# EAGLE design soth-core (EAGLE 7.2.0)
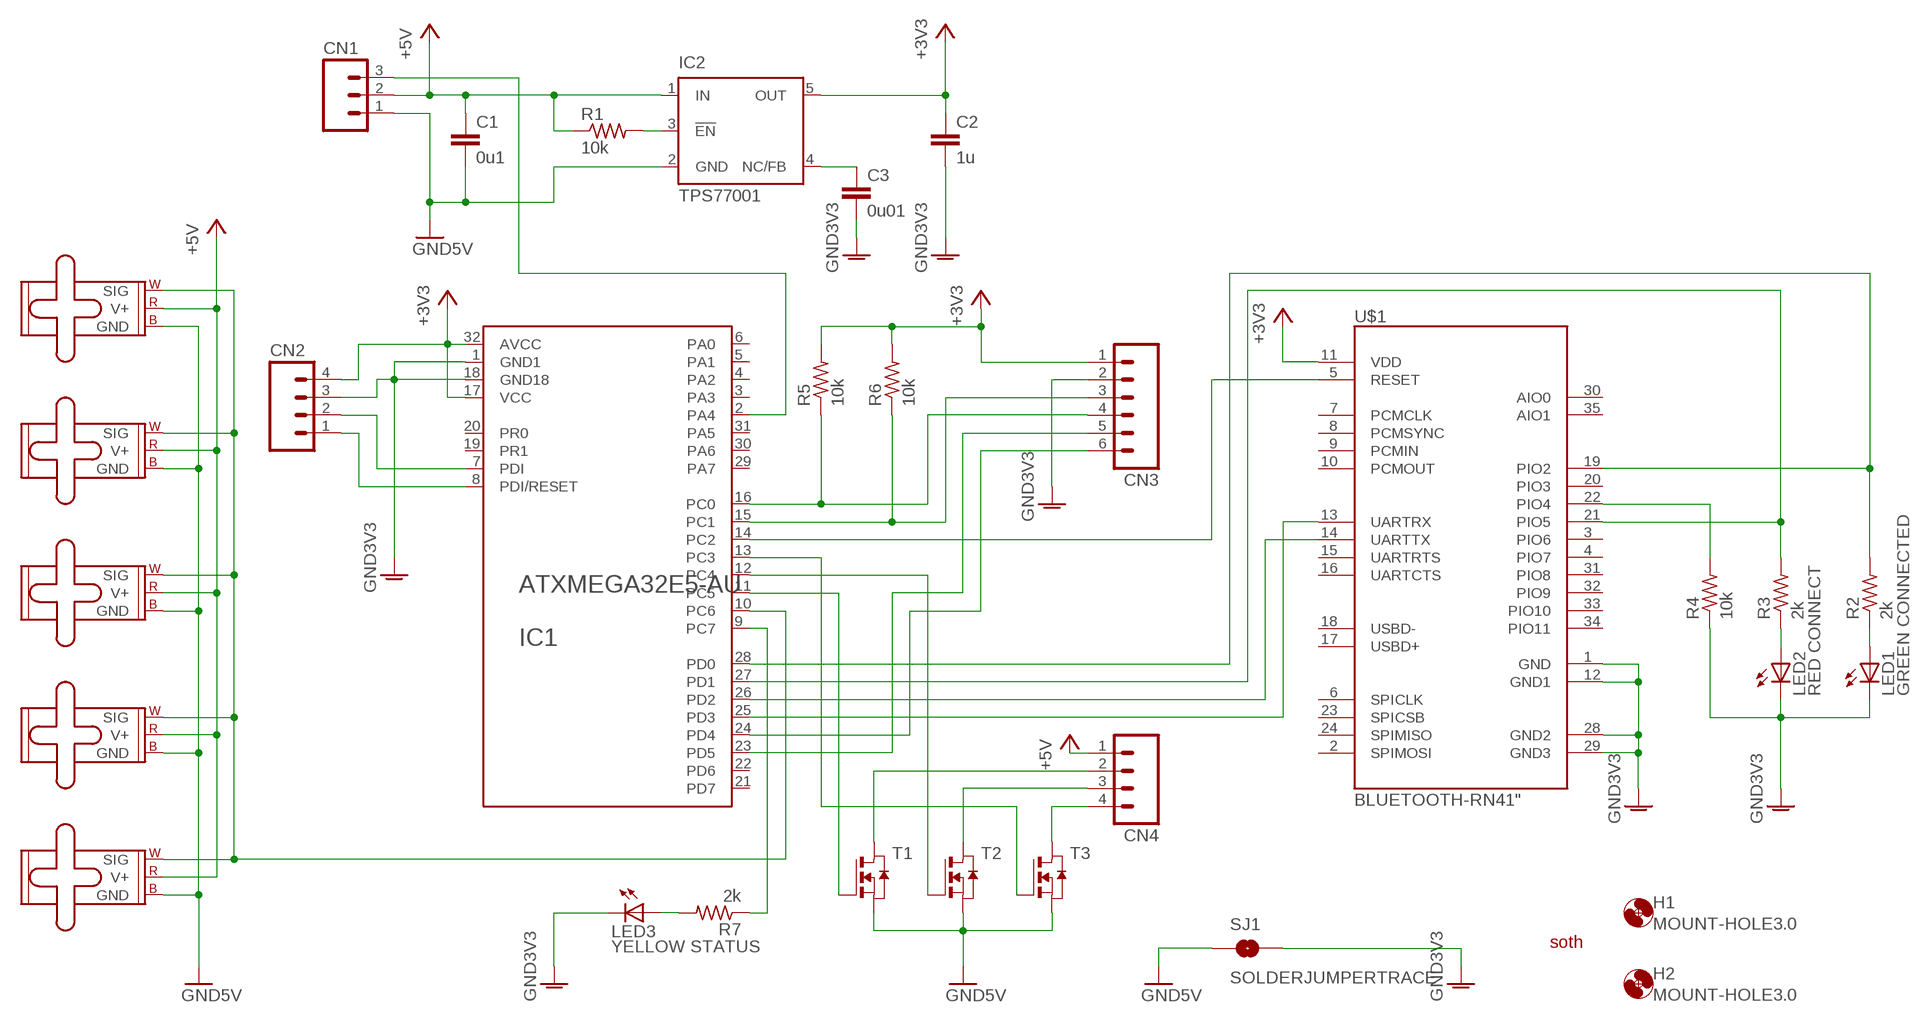
[diagram p0: schematic, sheet 1]

## Parts
C1  0u1  C-EUC1608  [C1608]
C2  1u  C-EUC1608  [C1608]
C3  0u01  C-EUC1608  [C1608]
CN1  M03PTH  [1X03]
CN2  M04PTH  [1X04]
CN3  M06SILK_FEMALE_PTH  [1X06]
CN4  M04PTH  [1X04]
H1  MOUNT-HOLE3.0  [3,0]
H2  MOUNT-HOLE3.0  [3,0]
IC1  ATXMEGA32E5-AU  ATXMEGA32E5/16E5/8E5ATXMEGA32E5-AU  [TQFP32-08]
IC2  TPS77001  [SOT23-DBV]
LED1  GREEN CONNECTED  LEDCHIPLED_1206  [CHIPLED_1206]
LED2  RED CONNECT  LEDCHIPLED_1206  [CHIPLED_1206]
LED3  YELLOW STATUS  LEDCHIPLED_1206  [CHIPLED_1206]
M1  SMALL_SERVO  [1X03]
M2  SMALL_SERVO  [1X03]
M3  SMALL_SERVO  [1X03]
M4  SMALL_SERVO  [1X03]
M5  SMALL_SERVO  [1X03]
R1  10k  R-US_R0603  [R0603]
R2  2k  R-US_R0603  [R0603]
R3  2k  R-US_R0603  [R0603]
R4  10k  R-US_R0603  [R0603]
R5  10k  R-US_R0603  [R0603]
R6  10k  R-US_R0603  [R0603]
R7  2k  R-US_R0603  [R0603]
SJ1  SOLDERJUMPERTRACE  [SJ_2S-TRACE]
T1  NMOSSOT23  [SOT-23]
T2  NMOSSOT23  [SOT-23]
T3  NMOSSOT23  [SOT-23]
U$1  BLUETOOTH-RN41"  [RN41]
U$2  SOTH_LOGO  [SILK_LOGO]

## Nets
+3V3 [VCC3V3]: C2.1 CN2.4 CN3.1 IC1.17(VCC) IC1.32(AVCC) IC2.5(OUT) R5.2 R6.2 U$1.11(VDD)
+5V [VCC5V]: C1.1 CN1.2 CN4.1 IC2.1(IN) M1.2(V+) M2.2(V+) M3.2(V+) M4.2(V+) M5.2(V+) R1.1
GND [GND5V]: C1.2 CN1.1 IC2.2(GND) M1.3(GND) M2.3(GND) M3.3(GND) M4.3(GND) M5.3(GND) SJ1.1 T1.2(S) T2.2(S) T3.2(S) ; supply symbol labelled GND5V
GNDA [GND3V3]: C2.2 C3.2 CN2.3 CN3.2 IC1.1(GND1) IC1.18(GND18) LED1.C LED2.C LED3.C R4.1 SJ1.2 U$1.1(GND) U$1.12(GND1) U$1.28(GND2) U$1.29(GND3) ; supply symbol labelled GND3V3
N$1: CN4.2 T1.1(D)
N$2: IC2.3(!EN) R1.2
N$3: IC1.26(PD2) U$1.14(UARTTX)
N$4: CN2.2 IC1.7(PDI)
N$5: CN2.1 IC1.8(PDI/RESET)
N$6: IC1.25(PD3) U$1.13(UARTRX)
N$7: IC1.27(PD1) R3.2 U$1.21(PIO5)
N$8: LED2.A R3.1
N$9: LED1.A R2.1
N$10: IC1.28(PD0) R2.2 U$1.19(PIO2)
N$11: R4.2 U$1.22(PIO4)
N$12: CN3.4 IC1.16(PC0) R5.1
N$13: CN3.3 IC1.15(PC1) R6.1
N$14: CN1.3 IC1.2(PA4)
N$15: CN4.3 T2.1(D)
N$16: CN4.4 T3.1(D)
N$17: IC1.9(PC7) R7.1
N$18: IC1.11(PC5) T1.3(G)
N$19: CN3.6 IC1.24(PD4)
N$20: IC1.10(PC6) M1.1(SIG) M2.1(SIG) M3.1(SIG) M4.1(SIG) M5.1(SIG)
N$21: CN3.5 IC1.23(PD5)
N$22: IC1.12(PC4) T2.3(G)
N$23: IC1.13(PC3) T3.3(G)
N$24: LED3.A R7.2
N$25: C3.1 IC2.4(NC/FB)
N$26: IC1.14(PC2) U$1.5(RESET)
Unconnected: IC1.3(PA3) IC1.4(PA2) IC1.5(PA1) IC1.6(PA0) IC1.19(PR1) IC1.20(PR0) IC1.21(PD7) IC1.22(PD6) IC1.29(PA7) IC1.30(PA6) IC1.31(PA5) U$1.2(SPIMOSI) U$1.3(PIO6) U$1.4(PIO7) U$1.6(SPICLK) U$1.7(PCMCLK) U$1.8(PCMSYNC) U$1.9(PCMIN) U$1.10(PCMOUT) U$1.15(UARTRTS) U$1.16(UARTCTS) U$1.17(USBD+) U$1.18(USBD-) U$1.20(PIO3) U$1.23(SPICSB) U$1.24(SPIMISO) U$1.30(AIO0) U$1.31(PIO8) U$1.32(PIO9) U$1.33(PIO10) U$1.34(PIO11) U$1.35(AIO1)

## Library data of the parts
C1-C3 = rcl:C-EU: CAPACITOR, European symbol
CN1 = SparkFun-Connectors:M03: Header 3 Standard 3-pin 0.1" header. Use with straight break away headers (SKU : PRT-00116), right angle break away headers (PRT-00553), swiss pins (PRT-00743), machine pins (PRT-00117), and female headers (PRT-00115). Molex polarized connector foot print use with SKU : PRT-08232 with associated crimp pins and housings.
CN2 CN4 = SparkFun-Connectors:M04: Header 4 Standard 4-pin 0.1" header. Use with straight break away headers (SKU : PRT-00116), right angle break away headers (PRT-00553), swiss pins (PRT-00743), machine pins (PRT-00117), and female headers (PRT-00115). Molex polarized connector foot print use with SKU : PRT-08231 with associated crimp pins and housings. 1MM SMD Version SKU: PRT-10208
CN3 = SparkFun-Connectors:M06: Header 6 Standard 6-pin 0.1" header. Use with straight break away headers (SKU : PRT-00116), right angle break away headers (PRT-00553), swiss pins (PRT-00743), machine pins (PRT-00117), and female headers (PRT-00115). Molex polarized connector foot print use with SKU : PRT-08094 with associated crimp pins and housings. NOTES ON THE VARIANTS LOCK and LOCK_LONGPADS... This footprint was designed to help hold the alignment of a through-hole component (i.e. 6-pin header) while soldering it into place. You may notice that each hole has been shifted either up or down by 0.005 of an inch from it's more standard position (which is a perfectly straight line). This slight alteration caused the pins (the squares in the middle) to touch the edges of the holes. Because they are alternating, it causes a "brace" to hold the component in place. 0.005 has proven to be the perfect amount of "off-center" position when using our standard breakaway headers. Although looks a little odd when you look at the bare footprint, once you have a header in there, the alteration is very hard to notice. Also,if you push a header all the way into place, it is covered up entirely on the bottom side. This idea of altering the position of holes to aid alignment will be further integrated into the Sparkfun Library for other footprints. It can help hold any component with 3 or more connection pins.; PROD_ID: CONN-08437
H1 H2 = holes:MOUNT-HOLE: MOUNTING HOLE with drill center marker
IC1 = atmega-atxmega:ATXMEGA32E5/16E5/8E5: 8/16-bit Atmel AVR XMEGA Microcontrollers
IC2 = texas:TPS770*: ULTRALOW-POWER 50-mA LOW-DROPOUT LINEAR REGULATORS 50-mA Low-Dropout Regulator Source: http://focus.ti.com/lit/ds/symlink/tps77001.pdf; MF: TEXAS INSTRUMENTS; MPN: TPS77001DBVT; OC_FARNELL: 8461554; OC_NEWARK: 77C1171
LED1-LED3 = led:LED: LED OSRAM: - CHIPLED LG R971, LG N971, LY N971, LG Q971, LY Q971, LO R971, LY R971 LH N974, LH R974 LS Q976, LO Q976, LY Q976 LO Q996 - Hyper CHIPLED LW Q18S LB Q993, LB Q99A, LB R99A - SideLED LS A670, LO A670, LY A670, LG A670, LP A670 LB A673, LV A673, LT A673, LW A673 LH A674 LY A675 LS A676, LA A676, LO A676, LY A676, LW A676 LS A679, LY A679, LG A679 - Hyper Micro SIDELED® LS Y876, LA Y876, LO Y876, LY Y876 LT Y87S - SmartLED LW L88C, LW L88S LB L89C, LB L89S, LG L890 LS L89K, LO L89K, LY L89K LS L896, LA L896, LO L896, LY L896 - TOPLED LS T670, LO T670, LY T670, LG T670, LP T670 LSG T670, LSP T670, LSY T670, LOP T670, LYG T670 LG T671, LOG T671, LSG T671 LB T673, LV T673, LT T673, LW T673 LH T674 LS T676, LA T676, LO T676, LY T676, LB T676, LH T676, LSB T676, LW T676 LB T67C, LV T67C, LT T67C, LS T67K, LO T67K, LY T67K, LW E67C LS E67B, LA E67B, LO E67B, LY E67B, LB E67C, LV E67C, LT E67C LW T67C LS T679, LY T679, LG T679 LS T770, LO T770, LY T770, LG T770, LP T770 LB T773, LV T773, LT T773, LW T773 LH T774 LS E675, LA E675, LY E675, LS T675 LS T776, LA T776, LO T776, LY T776, LB T776 LHGB T686 LT T68C, LB T68C - Hyper Mini TOPLED® LB M676 - Mini TOPLED Santana® LG M470 LS M47K, LO M47K, LY M47K Source: http://www.osram.convergy.de LUXEON: - LUMILED® LXK2-PW12-R00, LXK2-PW12-S00, LXK2-PW14-U00, LXK2-PW14-V00 LXK2-PM12-R00, LXK2-PM12-S00, LXK2-PM14-U00 LXK2-PE12-Q00, LXK2-PE12-R00, LXK2-PE12-S00, LXK2-PE14-T00, LXK2-PE14-U00 LXK2-PB12-K00, LXK2-PB12-L00, LXK2-PB12-M00, LXK2-PB14-N00, LXK2-PB14-P00, LXK2-PB14-Q00 LXK2-PR12-L00, LXK2-PR12-M00, LXK2-PR14-Q00, LXK2-PR14-R00 LXK2-PD12-Q00, LXK2-PD12-R00, LXK2-PD12-S00 LXK2-PH12-R00, LXK2-PH12-S00 LXK2-PL12-P00, LXK2-PL12-Q00, LXK2-PL12-R00 Source: www.luxeon.com KINGBRIGHT: KA-3528ASYC Source: www.kingbright.com
M1-M5 = SparkFun-Electromechanical:SMALL_SERVO: Small servo motor This is the small servo used in the SIK. SKU: ROB-09065
R1-R7 = rcl:R-US_: RESISTOR, American symbol
SJ1 = SparkFun-Retired:SOLDERJUMPER: Solder Jumper Standard SMD solder jumper. Used to automate production. Two varients : Normally Open and Normally Closed are the same, but have different paste layers. NC will have a large amount of paste and should jumper during reflow.
T1-T3 = zetex:NMOSSOT23: MOS FET; OC_FARNELL: unknown; OC_NEWARK: unknown
U$1 = SparkFun-RF:BLUETOOTH-RN41: Bluetooth SMD module
U$2 = Soth:SOTH_LOGO: soth slik logo

## Net classes
1 VCC5V: width 0.038 mm

## Board
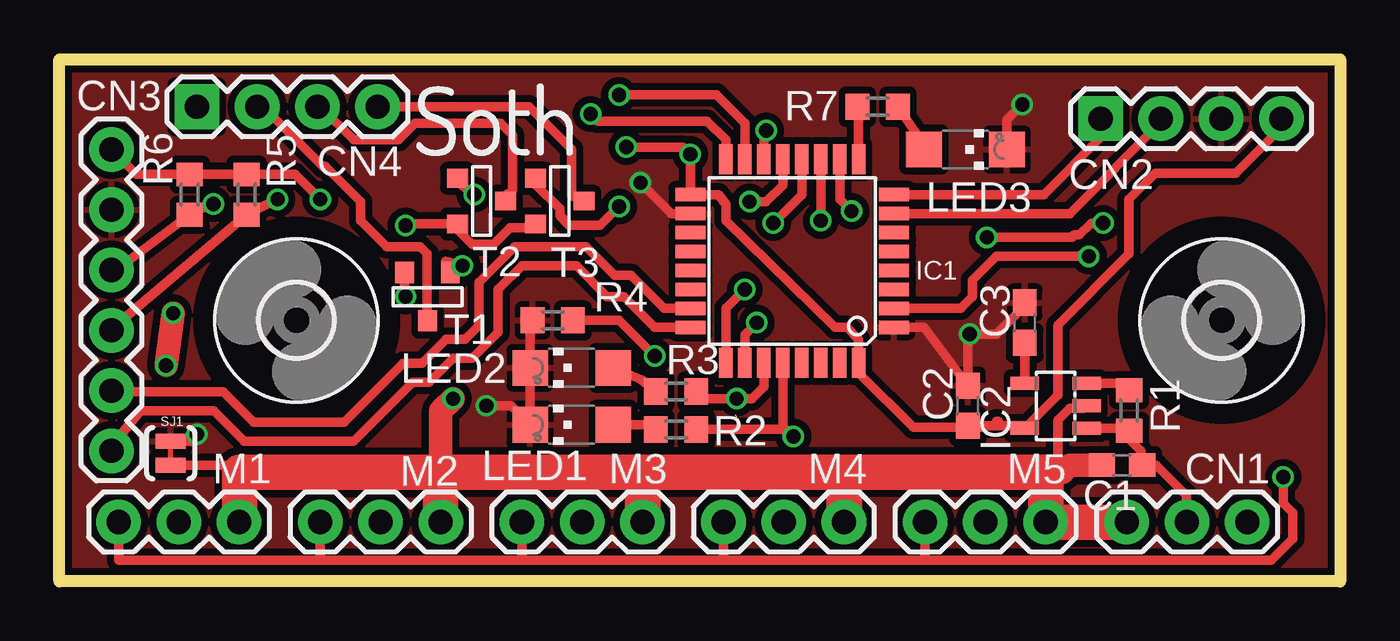
[diagram p1: board, top side]
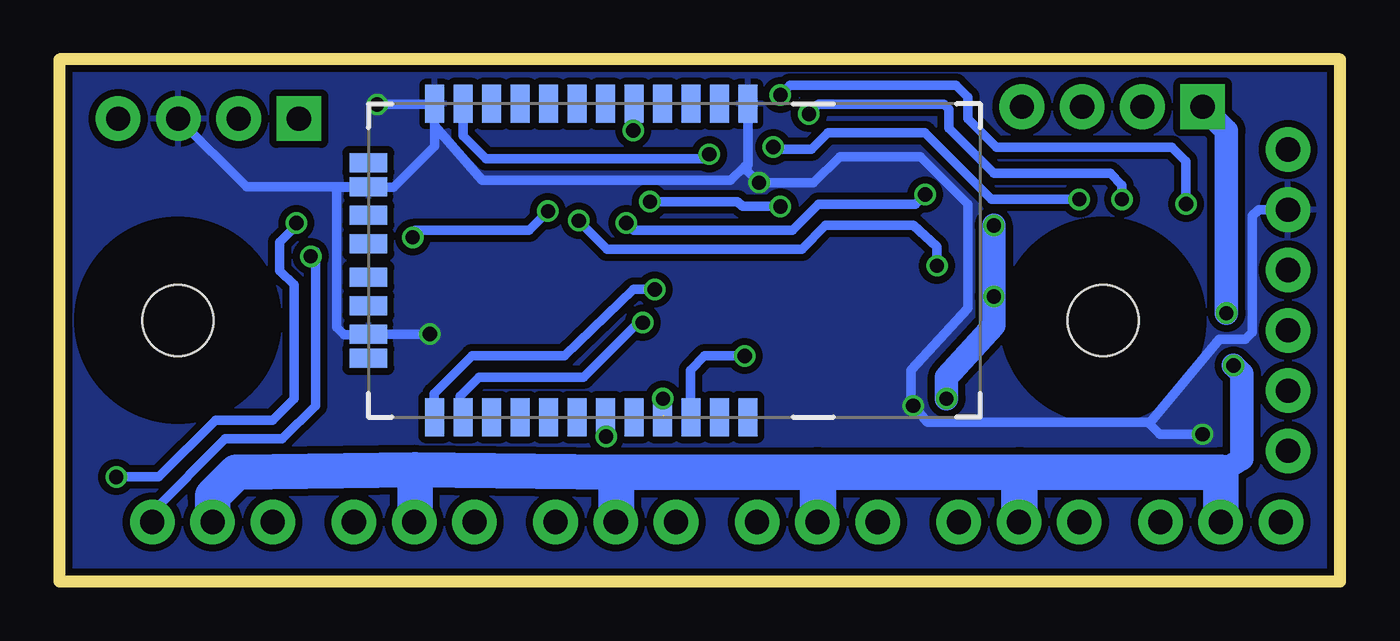
[diagram p2: board, bottom side, seen from below]

Size 54 x 22 mm. Coordinates in mm from the lower left corner, seen from the top.
Outline: 0,0 0,22 54,22 54,0 0,0
Copper layers (1*16): Top 0.035mm / dielectric 1.5mm / Bottom 0.035mm
Design rules "Elecrow_2-layer_eagle_rule": minimum track width 6mil, minimum drill 12mil, track to track 6mil, track to pad 6mil, pad to pad 6mil, via to via 6mil, smd to smd 0mil, copper to edge 10mil, drill to drill 10mil, minimum pad ring 10mil, minimum via ring 6mil, stop-mask expansion 2mil, vias tented up to drill 100mil, thermal gap 10mil

### Footprints (pad centres in the part's own frame; a part is rotated, then mirrored left to right if it is on the bottom)
C1608 = smd 1.1 x 1: 1 -0.85,0; 2 0.85,0
1X03 = drill 1.016 pad 1.88: 1 0,0; 2 2.54,0; 3 5.08,0
1X04 = drill 1.016 pad 1.88 square: 1 0,0 | drill 1.016 pad 1.88: 2 2.54,0; 3 5.08,0; 4 7.62,0
1X06 = drill 1.016 pad 1.88: 1 0,0; 2 2.54,0; 3 5.08,0; 4 7.62,0; 5 10.16,0; 6 12.7,0
3,0 = hole 3: 0,0
TQFP32-08 = smd 1.27 x 0.559: 1 -4.293,2.8; 2 -4.293,2; 3 -4.293,1.2; 4 -4.293,0.4; 5 -4.293,-0.4; 6 -4.293,-1.2; 7 -4.293,-2; 8 -4.293,-2.8; 17 4.293,-2.8; 18 4.293,-2; 19 4.293,-1.2; 20 4.293,-0.4; 21 4.293,0.4; 22 4.293,1.2; 23 4.293,2; 24 4.293,2.8 | smd 0.559 x 1.27: 9 -2.8,-4.293; 10 -2,-4.293; 11 -1.2,-4.293; 12 -0.4,-4.293; 13 0.4,-4.293; 14 1.2,-4.293; 15 2,-4.293; 16 2.8,-4.293; 25 2.8,4.293; 26 2,4.293; 27 1.2,4.293; 28 0.4,4.293; 29 -0.4,4.293; 30 -1.2,4.293; 31 -2,4.293; 32 -2.8,4.293
SOT23-DBV = smd 0.55 x 1.2: 1 -0.95,-1.3; 2 0,-1.3; 3 0.95,-1.3; 4 0.95,1.3; 5 -0.95,1.3
CHIPLED_1206 = smd 1.5 x 1.5: A 0,-1.75; C 0,1.75
R0603 = smd 1 x 1.1: 1 -0.85,0; 2 0.85,0
SJ_2S-TRACE = smd 0.635 x 1.27: 1 -0.508,0; 2 0.508,0
SOT-23 = smd 0.787 x 0.889: 1 0.025,-1.016; 2 -0.94,1.016; 3 0.991,1.016
RN41 = smd 0.8 x 1.6: 1 -6.6,-6.6; 2 -5.4,-6.6; 3 -4.2,-6.6; 4 -3,-6.6; 5 -1.8,-6.6; 6 -0.6,-6.6; 7 0.6,-6.6; 8 1.8,-6.6; 9 3,-6.6; 10 4.2,-6.6; 11 5.4,-6.6; 12 6.6,-6.6; 13 6.6,6.6; 14 5.4,6.6; 15 4.2,6.6; 16 3,6.6; 17 1.8,6.6; 18 0.6,6.6; 19 -0.6,6.6; 20 -1.8,6.6; 21 -3,6.6; 22 -4.2,6.6; 23 -5.4,6.6; 24 -6.6,6.6 | smd 1.6 x 0.8: 28 9.4,3.1; 29 9.4,-3.1; 30 9.4,4.122; 31 9.4,1.9; 32 9.4,0.7; 33 9.4,-0.7; 34 9.4,-1.9; 35 9.4,-4.122

### Placement (x,y rotation side)
C1  44.8,4.9 180 top
C2  38.3,7.4 90 top
C3  40.7,10.9 90 top
CN1  45,2.5 0 top
CN2  43.9,19.5 0 top
CN3  2.2,18.2 270 top
CN4  5.8,20 0 top
H1  10,11 90 top
H2  49,11 0 top
IC1  30.9,13.5 180 top
IC2  42,7.4 90 top
LED1  21.6,6.6 90 top
LED2  21.6,9 90 top
LED3  38.2,18.2 270 top
M1  2.5,2.5 0 top
M2  11,2.5 0 top
M3  19.5,2.5 0 top
M4  28,2.5 0 top
M5  36.5,2.5 0 top
R1  45.1,7.2 90 top
R2  26,6.4 0 top
R3  26,8 0 top
R4  20.8,11 0 top
R5  7.9,16.3 90 top
R6  5.5,16.3 90 top
R7  34.5,20 0 top
SJ1  4.7,5.4 90 top
T1  15.5,12 0 top
T2  17.8,16 90 top
T3  21.1,16 90 top
U$1  31.57,13.52 180 bottom
U$2  15.06,17.93 0 top

### Tracks (layer width: path | path; a pad name or v marks a point on that pad's centre or on a via)
+3V3  (via drill 0.6)
  Top 0.4: C2.1 38.85,6.5 36,6.5 33.7,8.8 IC1.32 33.7,10.2 33.2,10.7 32.7,10.7 28.1,15.2 28.1,15.9 27.8,16.3 IC1.17 v26.6,18 26.3,18.3 v23.9,18.3 | CN2.4 51.52,19.12 49.6,17.2 46.2,17.2 45.1,16.1 45.1,13.8 42.1,10.8 42.1,7.85 IC2.5 | R6.2 R5.2 | R5.2 3.25,17.15 CN3.1 | R5.2 9.95,17.15 v11,16.1
  Top 0.406: C2.1 39.5,6.55 | 39.5,6.55 40.7,6.55 IC2.5 | 39.6,6.75 39.5,6.75 39.5,6.55
  Bottom 0.4: U$1.11 36.97,18.77 36,17.8 26.8,17.8 v26.6,18 | v11,16.1 14.7,16.1 17.5,18.9 21.6,18.9 22.3,18.2 23.8,18.2 v23.9,18.3
+5V  (via drill 0.6)
  Top 0.4: CN1.2 47.52,2.52 47.52,3.62 46.24,4.9 C1.1 45.6,4.95 45.6,5.5 44.65,6.45 | IC2.1 45.1,6.45 R1.1
  Top 0.406: IC2.1 44.65,6.45
  Top 1: v4.5,9.1 v4.8,11.3
  Bottom 1: 5.04,4.6 4.14,5.16 4.14,8.74 v4.5,9.1 | v4.8,11.3 4.8,19 CN4.1
  Bottom 1.5: 39,4.7 39,2.5 M5.2 | 39,4.7 30.54,4.6 M4.2 30.5,2.5 30.5,4.6 22.04,4.6 M3.2 22,2.5 22,4.6 13.54,4.6 M2.2 13.5,2.5 13.5,4.6 5.04,4.6 M1.2 | 39,4.7 46.54,4.6 47.54,3.6 CN1.2
GND  (via drill 0.6)
  Top 0.4: v14.6,15 14.96,15.06 T2.2 16.78,14.82 17.4,14.2 18.3,14.2 19,14.9 19.92,14.9 T3.2 | T1.2 14.56,12.04 v14.6,12 | SJ1.1 7.31,4.89 7.6,4.6 | 42.6,4.9 42.1,4.9 42.1,6.8 42.6,7.3 43.2,7.3 IC2.2
  Top 1: 41.6,4.6 42.3,4.6 42.6,4.9 C1.2 | 16.08,4.6 16.08,7.18 v16.6,7.7
  Top 1.5: 33.1,4.6 41.6,4.6 41.6,2.5 M5.3 CN1.1 | 33.1,4.6 33.08,4.6 | 33.08,4.6 M4.3 33.1,2.5 33.1,4.6 | 33.08,4.6 24.6,4.6 | 24.6,4.6 24.58,4.6 | 24.58,4.6 M3.3 24.6,2.5 24.6,4.6 | 24.58,4.6 16.08,4.6 | M1.3 7.6,2.5 7.6,4.6 16.08,4.6 | 16.08,4.6 M2.3
  Bottom 1: v16.6,7.7 16.6,8.6 14.6,10.8 v14.6,12 v14.6,15
GNDA  (via drill 0.6)
  Top 0.4: IC1.1 36.45,10.7 C2.2 38.3,10.54 v38.38,10.42 39.5,10.42 40.7,11.62 C3.2 | IC1.18 25.8,15.5 v24.5,16.8 | LED1.C LED2.C | LED1.C 19.85,11.1 R4.1 | v18,7.4 19.05,7.4 LED1.C | SJ1.2 5.61,5.91 v5.8,6.2 | LED3.C 39.95,19.45 v40.6,20.1
  Bottom 0.4: U$1.1 24.97,17.53 25,17.5 | 38.17,19.2 U$1.12 38.19,20.1 v40.6,20.1 | v38.38,10.42 U$1.28 40.99,10.4 42,10.4 42.3,10.7 42.3,16.5 42.2,16.6 40.95,16.6 | CN2.3 46.1,16.62 U$1.29 40.95,16.6 | 25,17.5 25,17.3 v24.5,16.8 22.2,16.8 21.1,17.9 17.7,17.9 15.7,15.9 15.7,11.5 18.1,8.9 18.1,7.5 v18,7.4 17.4,6.7 8.1,6.7 | 25,17.5 25.1,17.5 25.7,16.9 36.17,16.9 38.17,19.2 | 38.17,19.2 38.17,18.33 39.9,16.6 40.95,16.6 | CN3.2 3.44,15.66 3.7,15.4 3.7,10.5 4,10.2 5.1,10.2 8,6.7 8.1,6.7 | v5.8,6.2 7.6,6.2 8.1,6.7
  pour Bottom (isolate 0.3): 0,22 54,22 54,0 0,0
  pour Top (isolate 0.3): 0,22 54,22 54,0 0,0
N$1
  Top 0.4: CN4.2 8.6,20 11.1,17.5 11.2,17.5 12.7,16 12.7,15.2 13.8,14.1 15.2,14.1 15.5,13.8 15.5,11.01 T1.1
N$2
  Top 0.4: IC2.3 45.1,8.35 R1.2
N$3  (via drill 0.6)
  Top 0.4: IC1.26 28.9,10.4 v29.4,10.9
  Bottom 0.4: v29.4,10.9 29.6,10.9 31.9,8.6 36.3,8.6 37.1,7.8 37.1,7.05 U$1.14
N$4
  Top 0.4: CN2.2 46.44,19.34 42.6,15.5 IC1.7
N$5
  Top 0.4: IC1.8 41.5,16.3 44,18.8 44,19.4 CN2.1
N$6  (via drill 0.6)
  Top 0.4: IC1.25 28.1,11.5 v28.9,12.3
  Bottom 0.4: v28.9,12.3 29.8,12.3 32.7,9.5 36.6,9.5 38.2,7.9 38.2,6.95 U$1.13
N$7  (via drill 0.6)  (1 unrouted)
  Top 0.4: IC1.27 29.7,8.2 29.2,7.7 v28.55,7.7 27.05,7.7 R3.2
  Bottom 0.4: v28.55,7.7 28.5,6.99
N$8
  Top 0.4: LED2.A 24.55,8.5 R3.1
N$9
  Top 0.4: LED1.A 24.95,6.6 R2.1
N$10  (via drill 0.6)
  Top 0.4: R2.2 30.6,6.4 v30.95,6.1 30.5,6.5 IC1.28
  Bottom 0.4: v30.95,6.1 30.9,6.85 U$1.19
N$11  (via drill 0.6)
  Top 0.4: R4.2 23.6,11 v25.1,9.5
  Bottom 0.4: v25.1,9.5 26.8,9.5 27.4,8.9 27.4,6.95 U$1.22
N$12  (via drill 0.6)
  Top 0.4: CN3.4 2.2,10.65 R5.1 7.85,15.45 v9.2,16.1 | v22.4,19.7 22.7,19.4 27.3,19.4 28.1,18.6 IC1.16
  Bottom 0.4: v9.2,16.1 9.2,16.7 9.7,17.2 14.6,17.2 16.5,19.1 16.5,19.9 16.7,20.1 22,20.1 v22.4,19.7
N$13  (via drill 0.6)
  Top 0.4: CN3.3 2.37,13.12 R6.1 5.15,15.45 v6.5,15.9 | v23.6,20.5 27.7,20.5 28.9,19.3 IC1.15
  Bottom 0.4: v6.5,15.9 6.5,17.7 7.1,18.3 14.5,18.3 15.7,19.5 15.7,20.4 16.2,20.9 23.2,20.9 v23.6,20.5
N$14  (via drill 0.6)
  Top 0.4: v43.4,13.7 43.4,13.8 42.9,13.7 39.5,13.7 38.5,12.7 38.5,12 38,11.5 IC1.2
  Bottom 0.4: 43.5,13.7 v43.4,13.7 43.2,13.9 43.2,7.4 44.6,6 47,6 50.1,2.9 50.1,2.52 CN1.3
N$15
  Top 0.4: CN4.3 11,20 12.4,18.6 14.3,18.6 15,19.3 18.6,19.3 19.1,18.8 19.1,16.51 T2.1 18.9,16.34
N$16
  Top 0.4: CN4.4 19.8,20 21.6,18.2 21.6,16.24 T3.1
N$17
  Top 0.4: IC1.9 33.7,19.55 R7.1
N$18  (via drill 0.6)
  Top 0.4: T1.3 16.29,13.49 v17,13.3 | v32.1,15.2 IC1.11
  Bottom 0.4: v17,13.3 17,14.1 18,15 21.7,15 22.7,14 30.9,14 v32.1,15.2
N$19
  Top 0.4: IC1.24 25.1,10.7 23.8,12 23.1,12 21.8,13.3 19.5,13.3 18.5,12.3 18.5,10.5 17.4,9.4 16.6,9.4 15.6,8.4 14.9,8.4 12.4,5.9 7.8,5.9 6.5,7.2 3.4,7.2 2.2,5.7 CN3.6 2.2,5.4
N$20  (via drill 0.6)
  Top 0.4: M1.1 2.5,0.9 11,0.9 | M2.1 11,0.9 | 11,0.9 19.5,0.9 | M3.1 19.5,0.9 | 19.5,0.9 28,0.9 | M4.1 28,0.9 | 28,0.9 36.5,0.9 | 36.5,0.9 M5.1 | IC1.10 32.9,16.1 v33.4,15.6 | v39.1,14.5 42.7,14.5 42.8,14.6 43,14.6 43.5,15.1 v44,15.1 | v51.6,4.4 51.6,3.3 52,2.9 52,1.8 51.1,0.9 36.5,0.9
  Bottom 0.4: v33.4,15.6 34.2,14.8 39,14.8 v39.1,14.5 | v44,15.1 44,15 44.7,14.3 44.7,13.1 44.1,12.5 44.1,7.7 45,6.8 47.4,6.8 49.8,4.4 v51.6,4.4
N$21
  Top 0.4: IC1.23 25.5,11.5 24.1,12.9 23.4,12.9 22.2,14.1 19.2,14.1 17.7,12.6 17.7,10.8 17.1,10.2 16.3,10.2 15.3,9.2 14.5,9.2 12,6.7 8.2,6.7 6.9,8 2.2,8 CN3.5 2.2,8.1
N$22  (via drill 0.6)
  Top 0.4: T2.3 16.78,16.82 v17.5,16.3 | v30.1,15.1 31.3,16.3 IC1.12
  Bottom 0.4: v30.1,15.1 29.8,14.8 23.1,14.8 22,15.9 17.9,15.9 v17.5,16.3
N$23  (via drill 0.6)
  Top 0.4: T3.3 20.08,16.72 21.1,15.7 21.1,15.4 21.5,15 22.8,15 v23.6,15.8 | v29.1,16 29.8,16 30.5,16.7 IC1.13
  Bottom 0.4: v23.6,15.8 25.2,15.8 25.4,16 v29.1,16
N$24
  Top 0.4: R7.2 36.45,18.4 LED3.A
N$25
  Top 0.4: C3.1 IC2.4
N$26  (via drill 0.6)
  Top 0.4: IC1.14 29.7,18.9 v29.8,19
  Bottom 0.4: v29.8,19 29.8,20.09 U$1.5